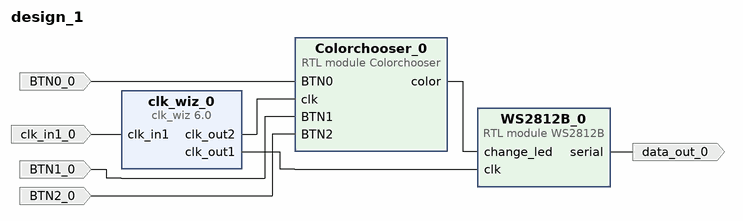
[diagram p0: block diagram of the top level]
# Vivado block design design_1, xc7z020clg400-1, Vivado 2024.1
create_bd_design design_1

create_bd_port -dir I -type clk clk_in1_0
set_property -dict {CONFIG.FREQ_HZ 120000000} [get_bd_ports clk_in1_0]
create_bd_port -dir O data_out_0
create_bd_port -dir I BTN0_0
create_bd_port -dir I BTN1_0
create_bd_port -dir I BTN2_0

create_bd_cell -type ip -vlnv xilinx.com:ip:clk_wiz:6.0 clk_wiz_0
set_property -dict [list \
  CONFIG.CLKIN1_JITTER_PS 83.33 \
  CONFIG.CLKIN2_JITTER_PS 100.0 \
  CONFIG.CLKOUT1_JITTER 200.038 \
  CONFIG.CLKOUT1_PHASE_ERROR 191.950 \
  CONFIG.CLKOUT1_REQUESTED_OUT_FREQ 50 \
  CONFIG.CLKOUT2_JITTER 165.993 \
  CONFIG.CLKOUT2_PHASE_ERROR 191.950 \
  CONFIG.CLKOUT2_REQUESTED_OUT_FREQ 125.000 \
  CONFIG.CLKOUT2_USED true \
  CONFIG.CLK_IN1_BOARD_INTERFACE Custom \
  CONFIG.MMCM_CLKFBOUT_MULT_F 25.000 \
  CONFIG.MMCM_CLKIN1_PERIOD 8.333 \
  CONFIG.MMCM_CLKIN2_PERIOD 10.000 \
  CONFIG.MMCM_CLKOUT0_DIVIDE_F 20.000 \
  CONFIG.MMCM_CLKOUT1_DIVIDE 8 \
  CONFIG.NUM_OUT_CLKS 2 \
  CONFIG.SECONDARY_SOURCE Single_ended_clock_capable_pin \
  CONFIG.USE_INCLK_SWITCHOVER false \
  CONFIG.USE_LOCKED false \
  CONFIG.USE_RESET false \
] [get_bd_cells clk_wiz_0]
create_bd_cell -type module -reference Colorchooser Colorchooser_0
create_bd_cell -type module -reference WS2812B WS2812B_0

# ---- connections ----

connect_bd_net -net BTN0_0_1 [get_bd_ports BTN0_0] [get_bd_pins Colorchooser_0/BTN0]
connect_bd_net -net BTN1_0_1 [get_bd_ports BTN1_0] [get_bd_pins Colorchooser_0/BTN1]
connect_bd_net -net BTN2_0_1 [get_bd_ports BTN2_0] [get_bd_pins Colorchooser_0/BTN2]
connect_bd_net [get_bd_pins Colorchooser_0/color] [get_bd_pins WS2812B_0/change_led]
connect_bd_net [get_bd_pins WS2812B_0/serial] [get_bd_ports data_out_0]
connect_bd_net -net clk_in1_0_1 [get_bd_ports clk_in1_0] [get_bd_pins clk_wiz_0/clk_in1]
connect_bd_net [get_bd_pins clk_wiz_0/clk_out1] [get_bd_pins WS2812B_0/clk]
connect_bd_net [get_bd_pins clk_wiz_0/clk_out2] [get_bd_pins Colorchooser_0/clk]

validate_bd_design
save_bd_design
